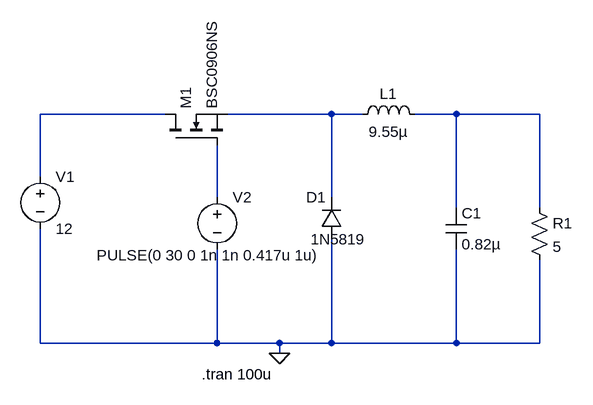
[diagram p0: schematic buck_converter.asc]
buck_converter.asc, the LTspice schematic file:
Version 4.1
SHEET 1 880 680
WIRE 240 -16 48 -16
WIRE 496 -16 336 -16
WIRE 544 -16 496 -16
WIRE 688 -16 624 -16
WIRE 816 -16 688 -16
WIRE 48 80 48 -16
WIRE 320 112 320 32
WIRE 496 112 496 -16
WIRE 688 128 688 -16
WIRE 816 128 816 -16
WIRE 48 336 48 160
WIRE 320 336 320 192
WIRE 320 336 48 336
WIRE 416 336 320 336
WIRE 496 336 496 176
WIRE 496 336 416 336
WIRE 688 336 688 192
WIRE 688 336 496 336
WIRE 816 336 816 208
WIRE 816 336 688 336
WIRE 416 352 416 336
FLAG 416 352 0
SYMBOL voltage 48 64 R0
WINDOW 123 0 0 Left 0
WINDOW 39 0 0 Left 0
SYMATTR InstName V1
SYMATTR Value 12
SYMBOL voltage 320 96 R0
WINDOW 3 -185 105 Left 2
WINDOW 123 0 0 Left 0
WINDOW 39 0 0 Left 0
SYMATTR Value PULSE(0 30 0 1n 1n 0.417u 1u)
SYMATTR InstName V2
SYMBOL res 800 112 R0
SYMATTR InstName R1
SYMATTR Value 5
SYMBOL cap 672 128 R0
SYMATTR InstName C1
SYMATTR Value 0.82µ
SYMATTR SpiceLine V=10 Irms=8.04 Rser=0.0145274 Lser=0 mfg="KEMET" pn="C0805C824K8RAC" type="X7R"
SYMBOL ind 528 0 R270
WINDOW 0 32 56 VTop 2
WINDOW 3 5 56 VBottom 2
SYMATTR InstName L1
SYMATTR Value 9.55µ
SYMATTR SpiceLine Ipk=1.9 Rser=0.088 Rpar=899.61 Cpar=0 mfg="Coilcraft" pn="DO1813H-103"
SYMBOL diode 512 176 R180
WINDOW 0 24 64 Left 2
WINDOW 3 -37 0 Left 2
SYMATTR InstName D1
SYMATTR Value 1N5819
SYMBOL nmos 240 32 R270
SYMATTR InstName M1
SYMATTR Value BSC0906NS
TEXT 296 384 Left 2 !.tran 100u

The netlist it stands for:
* buck_converter.asc
V1 N001 0 12
V2 N004 0 PULSE(0 30 0 1n 1n 0.417u 1u)
R1 N003 0 5
C1 N003 0 0.82µ V=10 Irms=8.04 Rser=0.0145274 Lser=0 mfg="KEMET" pn="C0805C824K8RAC" type="X7R"
L1 N002 N003 9.55µ Ipk=1.9 Rser=0.088 Rpar=899.61 Cpar=0 mfg="Coilcraft" pn="DO1813H-103"
D1 0 N002 1N5819
M1 N001 N004 N002 N002 BSC0906NS
.model D D
.lib standard.dio
.model NMOS NMOS
.model PMOS PMOS
.lib standard.mos
.tran 100u
.backanno
.end